# EAGLE design mgr (EAGLE 7.1.0)
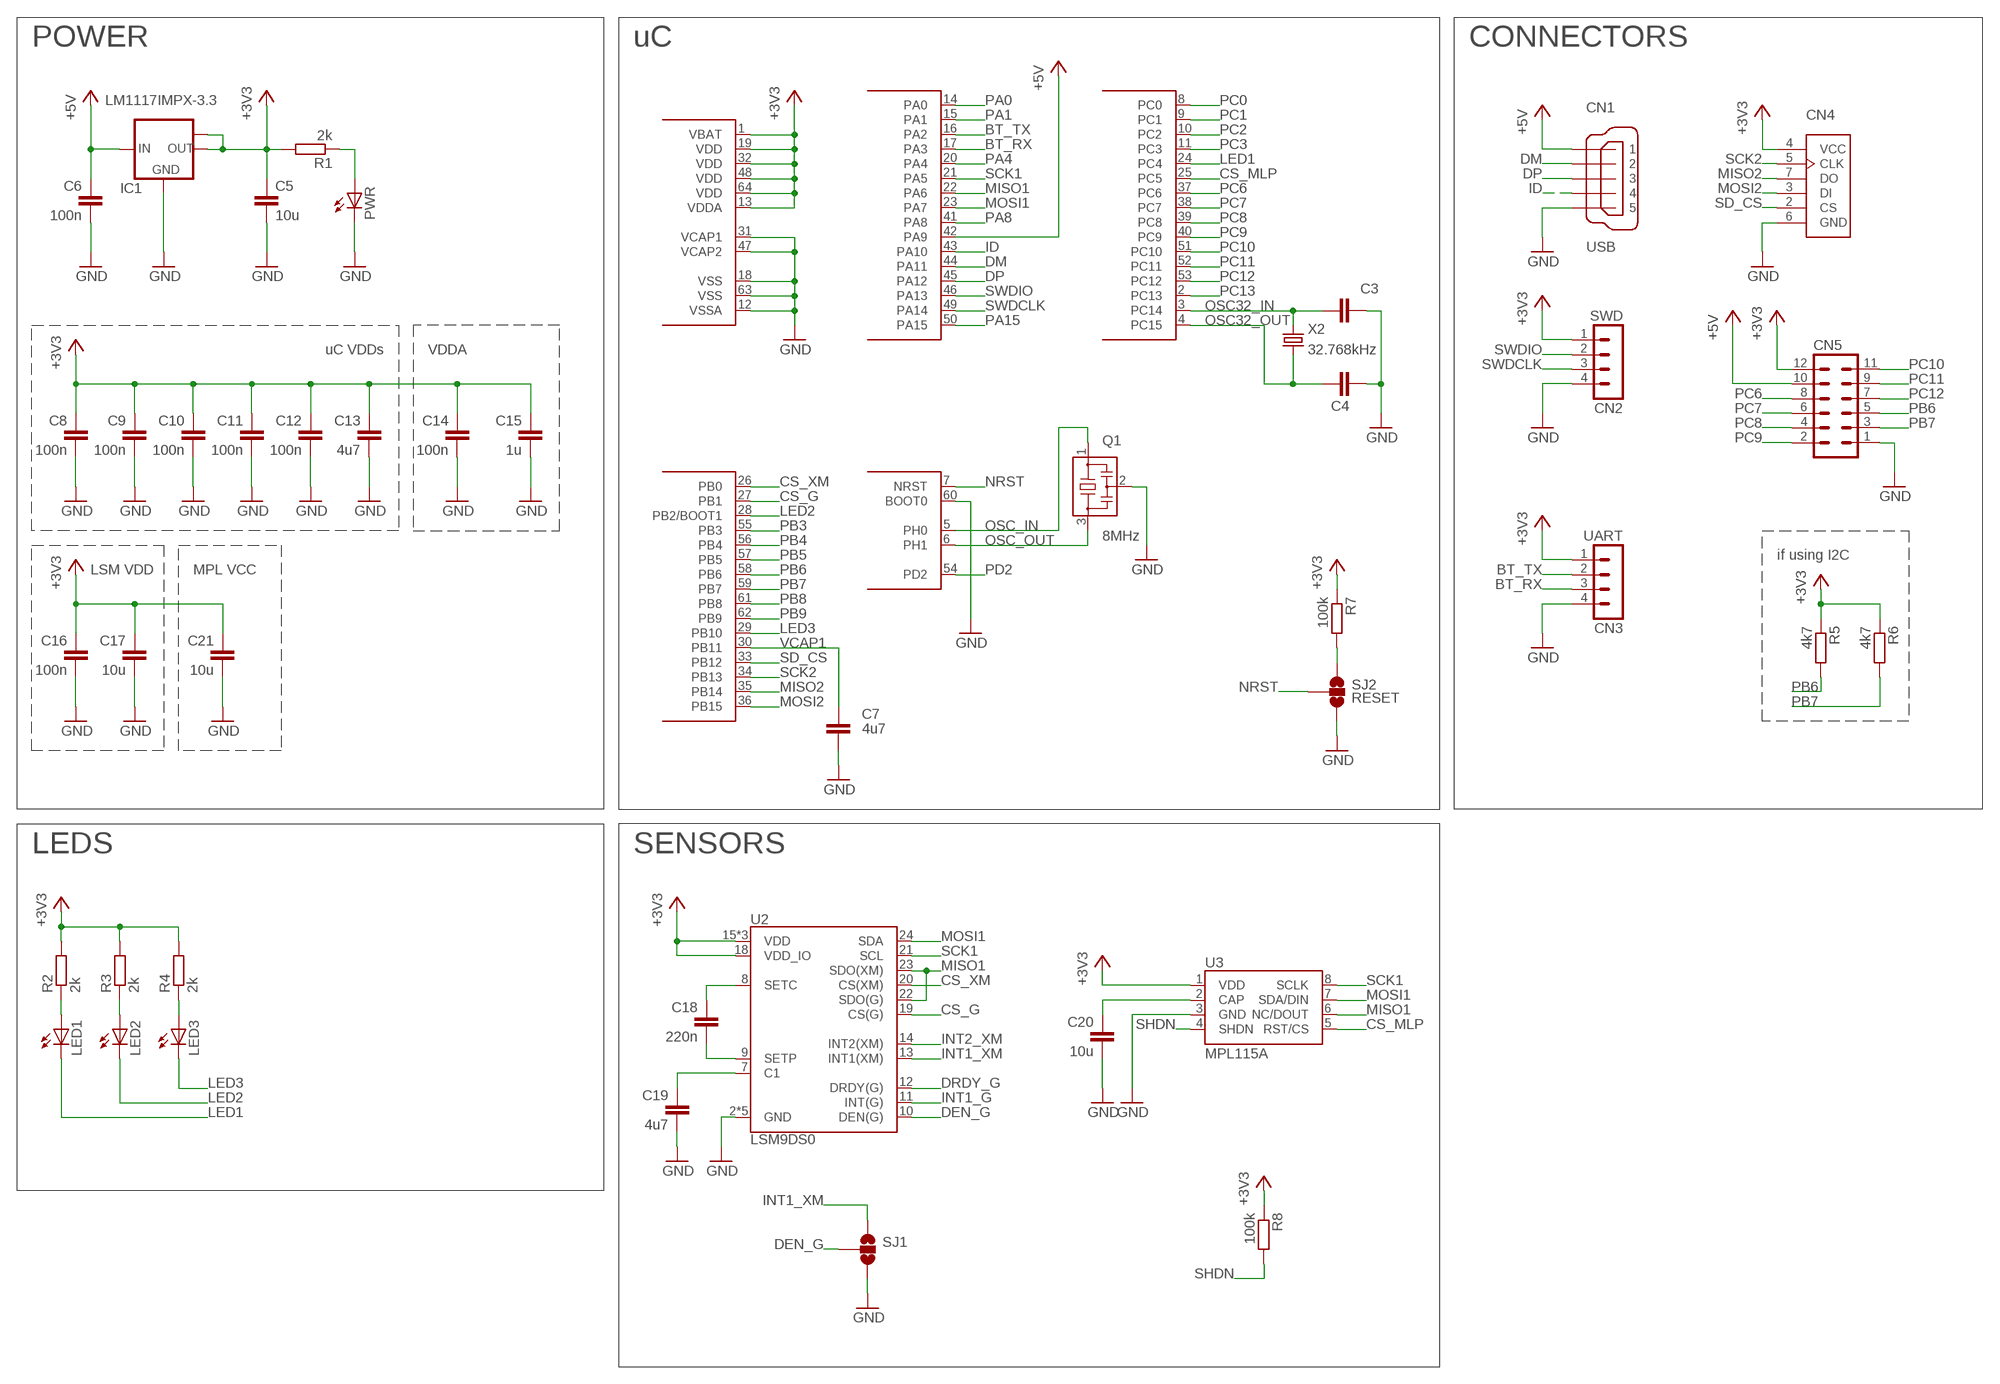
[diagram p0: schematic, sheet 1]

## Parts
C3  C-EUC0603K  [C0603K]
C4  C-EUC0603K  [C0603K]
C5  10u  C-EUC0603K  [C0603K]
C6  100n  C-EUC0603K  [C0603K]
C7  4u7  C-EUC0603K  [C0603K]
C8  100n  C-EUC0603K  [C0603K]
C9  100n  C-EUC0603K  [C0603K]
C10  100n  C-EUC0603K  [C0603K]
C11  100n  C-EUC0603K  [C0603K]
C12  100n  C-EUC0603K  [C0603K]
C13  4u7  C-EUC0603K  [C0603K]
C14  100n  C-EUC0603K  [C0603K]
C15  1u  C-EUC0603K  [C0603K]
C16  100n  C-EUC0603K  [C0603K]
C17  10u  C-EUC0603K  [C0603K]
C18  220n  C-EUC0603K  [C0603K]
C19  4u7  C-EUC0603K  [C0603K]
C20  10u  C-EUC0603K  [C0603K]
C21  10u  C-EUC0603K  [C0603K]
CN1  USB  MINI-USB-UX60-MB-5ST  [UX60-MB-5ST]
CN2  SWD  MA04-1  [MA04-1]
CN3  UART  MA04-1  [MA04-1]
CN4  MICRO_SD_CONNECTOR  [MICROSD_CONNECTOR]
CN5  MA06-2  [MA06-2]
IC1  LM1117IMPX-3.3  [SOT223]
LED1  LEDSML0603  [SML0603]
LED2  LEDSML0603  [SML0603]
LED3  LEDSML0603  [SML0603]
PWR  LEDSML0603  [SML0603]
Q1  8MHz  CSTCR6M00G53Z  [CSTCR6M]
R1  2k  R-EU_R0603  [R0603]
R2  2k  R-EU_R0603  [R0603]
R3  2k  R-EU_R0603  [R0603]
R4  2k  R-EU_R0603  [R0603]
R5  4k7  R-EU_R0603  [R0603]
R6  4k7  R-EU_R0603  [R0603]
R7  100k  R-EU_R0603  [R0603]
R8  100k  R-EU_R0603  [R0603]
SJ1  JUMPER-PAD-3-NOYES_SILK  [PAD-JUMPER-3-NO_YES_SILK]
SJ2  RESET  JUMPER-PAD-3-NOYES_SILK  [PAD-JUMPER-3-NO_YES_SILK]
U1  STM32F4-64  [SQFP-S-10X10-64]
U2  LSM9DS0  [LGA-24]
U3  MPL115A  [LGA8]
X2  32.768kHz  CRYSTALS-NOGND-CFPX-217  [3.2X1.5-2-PAD]

## Nets
+3V3: C5.2 C8.2 C9.2 C10.2 C11.2 C12.2 C13.2 C14.2 C15.2 C16.2 C17.2 C21.2 CN2.1 CN3.1 CN4.4(VCC) CN5.12 IC1.2(OUT) IC1.TAB(OUT1) R1.2 R2.2 R3.2 R4.2 R5.1 R6.1 R7.1 R8.1 U1.1(VBAT) U1.13(VDDA) U1.19(VDD) U1.32(VDD) U1.48(VDD) U1.64(VDD) U2.15(VDD) U2.16(VDD) U2.17(VDD) U2.18(VDD_IO) U3.1(VDD)
+5V: C6.2 CN1.1 CN5.10 IC1.3(IN) U1.42(PA9)
BT_RX: CN3.3 U1.17(PA3)
BT_TX: CN3.2 U1.16(PA2)
CS_G: U1.27(PB1) U2.19(CS(G))
CS_MLP: U1.25(PC5) U3.5(RST/CS)
CS_XM: U1.26(PB0) U2.20(CS(XM))
DEN_G: SJ1.2 U2.10(DEN(G))
DM: CN1.2 U1.44(PA11)
DP: CN1.3 U1.45(PA12)
DRDY_G: U2.12(DRDY(G))
GND: C3.2 C4.2 C5.1 C6.1 C7.2 C8.1 C9.1 C10.1 C11.1 C12.1 C13.1 C14.1 C15.1 C16.1 C17.1 C19.1 C20.1 C21.1 CN1.5 CN2.4 CN3.4 CN4.6(GND) CN5.1 IC1.1(GND) PWR.C Q1.2 SJ1.3 SJ2.3 U1.12(VSSA) U1.18(VSS) U1.31(VCAP1) U1.47(VCAP2) U1.60(BOOT0) U1.63(VSS) U2.2(GND) U2.3(GND) U2.4(GND) U2.5(GND) U2.6(GND) U3.3(GND)
ID: CN1.4 U1.43(PA10)
INT1_G: U2.11(INT(G))
INT1_XM: SJ1.1 U2.13(INT1(XM))
INT2_XM: U2.14(INT2(XM))
LED1: LED1.C U1.24(PC4)
LED2: LED2.C U1.28(PB2/BOOT1)
LED3: LED3.C U1.29(PB10)
MISO1: U1.22(PA6) U2.22(SDO(G)) U2.23(SDO(XM)) U3.6(NC/DOUT)
MISO2: CN4.7(DO) U1.35(PB14)
MOSI1: U1.23(PA7) U2.24(SDA) U3.7(SDA/DIN)
MOSI2: CN4.3(DI) U1.36(PB15)
N$1: PWR.A R1.1
N$2: C19.2 U2.7(C1)
N$3: C18.1 U2.9(SETP)
N$4: C18.2 U2.8(SETC)
N$5: LED1.A R2.1
N$6: LED2.A R3.1
N$7: LED3.A R4.1
N$8: C20.2 U3.2(CAP)
N$11: R7.2 SJ2.1
NRST: SJ2.2 U1.7(NRST)
OSC32_IN: C3.1 U1.3(PC14) X2.1
OSC32_OUT: C4.1 U1.4(PC15) X2.2
OSC_IN: Q1.1 U1.5(PH0)
OSC_OUT: Q1.3 U1.6(PH1)
PA0: U1.14(PA0)
PA1: U1.15(PA1)
PA4: U1.20(PA4)
PA8: U1.41(PA8)
PA15: U1.50(PA15)
PB3: U1.55(PB3)
PB4: U1.56(PB4)
PB5: U1.57(PB5)
PB6: CN5.5 R5.2 U1.58(PB6)
PB7: CN5.3 R6.2 U1.59(PB7)
PB8: U1.61(PB8)
PB9: U1.62(PB9)
PC0: U1.8(PC0)
PC1: U1.9(PC1)
PC2: U1.10(PC2)
PC3: U1.11(PC3)
PC6: CN5.8 U1.37(PC6)
PC7: CN5.6 U1.38(PC7)
PC8: CN5.4 U1.39(PC8)
PC9: CN5.2 U1.40(PC9)
PC10: CN5.11 U1.51(PC10)
PC11: CN5.9 U1.52(PC11)
PC12: CN5.7 U1.53(PC12)
PC13: U1.2(PC13)
PD2: U1.54(PD2)
SCK1: U1.21(PA5) U2.21(SCL) U3.8(SCLK)
SCK2: CN4.5(CLK) U1.34(PB13)
SD_CS: CN4.2(CS) U1.33(PB12)
SHDN: R8.2 U3.4(SHDN)
SWDCLK: CN2.3 U1.49(PA14)
SWDIO: CN2.2 U1.46(PA13)
VCAP1: C7.1 U1.30(PB11)

## Notes on the sheet
- POWER | uC | CONNECTORS
- uC VDDs | VDDA
- if using I2C
- LSM VDD | MPL VCC
- LEDS | SENSORS

## Library data of the parts
C3-C21 = resistor:C-EU: CAPACITOR, European symbol; SPICEPREFIX: C
CN1 = con-hirose:MINI-USB-: MINI USB Connector Source: http://www.hirose.co.jp/cataloge_hp/e24000019.pdf; OC_FARNELL: unknown; OC_NEWARK: unknown
CN2 CN3 = con-lstb:MA04-1: PIN HEADER; OC_FARNELL: unknown; OC_NEWARK: unknown
CN4 = mgr_con_sd:MICRO_SD_CONNECTOR: MicroSD connector with SPI interface
CN5 = con-lstb:MA06-2: PIN HEADER; OC_FARNELL: unknown; OC_NEWARK: unknown
IC1 = lm1117:LM1117IMPX-*
LED1-LED3 PWR = led:LED: LED OSRAM: - CHIPLED LG R971, LG N971, LY N971, LG Q971, LY Q971, LO R971, LY R971 LH N974, LH R974 LS Q976, LO Q976, LY Q976 LO Q996 - Hyper CHIPLED LW Q18S LB Q993, LB Q99A, LB R99A - SideLED LS A670, LO A670, LY A670, LG A670, LP A670 LB A673, LV A673, LT A673, LW A673 LH A674 LY A675 LS A676, LA A676, LO A676, LY A676, LW A676 LS A679, LY A679, LG A679 - Hyper Micro SIDELED® LS Y876, LA Y876, LO Y876, LY Y876 LT Y87S - SmartLED LW L88C, LW L88S LB L89C, LB L89S, LG L890 LS L89K, LO L89K, LY L89K LS L896, LA L896, LO L896, LY L896 - TOPLED LS T670, LO T670, LY T670, LG T670, LP T670 LSG T670, LSP T670, LSY T670, LOP T670, LYG T670 LG T671, LOG T671, LSG T671 LB T673, LV T673, LT T673, LW T673 LH T674 LS T676, LA T676, LO T676, LY T676, LB T676, LH T676, LSB T676, LW T676 LB T67C, LV T67C, LT T67C, LS T67K, LO T67K, LY T67K, LW E67C LS E67B, LA E67B, LO E67B, LY E67B, LB E67C, LV E67C, LT E67C LW T67C LS T679, LY T679, LG T679 LS T770, LO T770, LY T770, LG T770, LP T770 LB T773, LV T773, LT T773, LW T773 LH T774 LS E675, LA E675, LY E675, LS T675 LS T776, LA T776, LO T776, LY T776, LB T776 LHGB T686 LT T68C, LB T68C - Hyper Mini TOPLED® LB M676 - Mini TOPLED Santana® LG M470 LS M47K, LO M47K, LY M47K Source: http://www.osram.convergy.de LUXEON: - LUMILED® LXK2-PW12-R00, LXK2-PW12-S00, LXK2-PW14-U00, LXK2-PW14-V00 LXK2-PM12-R00, LXK2-PM12-S00, LXK2-PM14-U00 LXK2-PE12-Q00, LXK2-PE12-R00, LXK2-PE12-S00, LXK2-PE14-T00, LXK2-PE14-U00 LXK2-PB12-K00, LXK2-PB12-L00, LXK2-PB12-M00, LXK2-PB14-N00, LXK2-PB14-P00, LXK2-PB14-Q00 LXK2-PR12-L00, LXK2-PR12-M00, LXK2-PR14-Q00, LXK2-PR14-R00 LXK2-PD12-Q00, LXK2-PD12-R00, LXK2-PD12-S00 LXK2-PH12-R00, LXK2-PH12-S00 LXK2-PL12-P00, LXK2-PL12-Q00, LXK2-PL12-R00 Source: www.luxeon.com KINGBRIGHT: KA-3528ASYC Source: www.kingbright.com
Q1 = murata-filter:CSTCR: Resonator Source: murata.co.jp; MPN: CSTCR6M00G53-R0; OC_FARNELL: 1170434; OC_NEWARK: 25M8759
R1-R8 = resistor:R-EU_: RESISTOR, European symbol; SPICEPREFIX: R
SJ1 SJ2 = SparkFun-Passives:JUMPER-PAD-3-NO
U1 = apbteam_stm32:STM32F4-64: STM32F4, 64 pin package According to STM32F40x datasheet, compatible with STM32F4xx, STM32F2xx. Also compatible with STM32F10x, if VCAP1 and VCAP2 are connected directly to VSS.
U2 = SparkFun-DigitalIC:LSM9DS0: LSM9DS0 3D Accelerometer, 3D Gyroscope, 3D Magnetomter Features: 3 acceleration channels, 3 angular rate channels, 3 magnetic field channels ±2/±4/±6/±8/±16 g linear acceleration full scale ±2/±4/±8/±12 gauss magnetic full scale ±245/±500/±2000 dps angular rate full scale 16-bit data output SPI / I2C serial interfaces Analog supply voltage 2.4 V to 3.6 V Power-down mode / low-power mode Programmable interrupt generators Embedded self-test Embedded temperature sensor Embedded FIFO Position and motion detection functions Click/double-click recognition
U3 = SparkFun-Sensors:MPL115A: MPL115A1 (SPI) and MPL115A2 (I2C) Miniature Digital Barometer 5.0x3.0x1.2mm LGA Package
X2 = IQD-Frequency-Products:CRYSTALS-NOGND: CRYSTALS CAN NOT GROUNDED

## Board
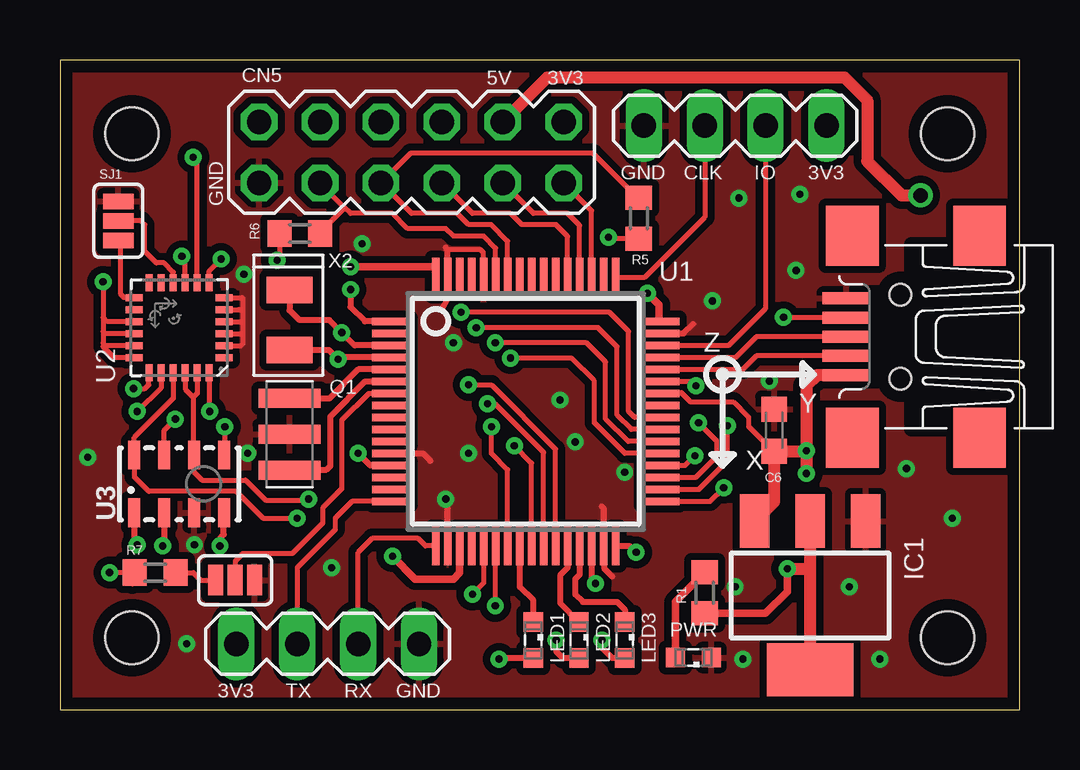
[diagram p1: board, top side]
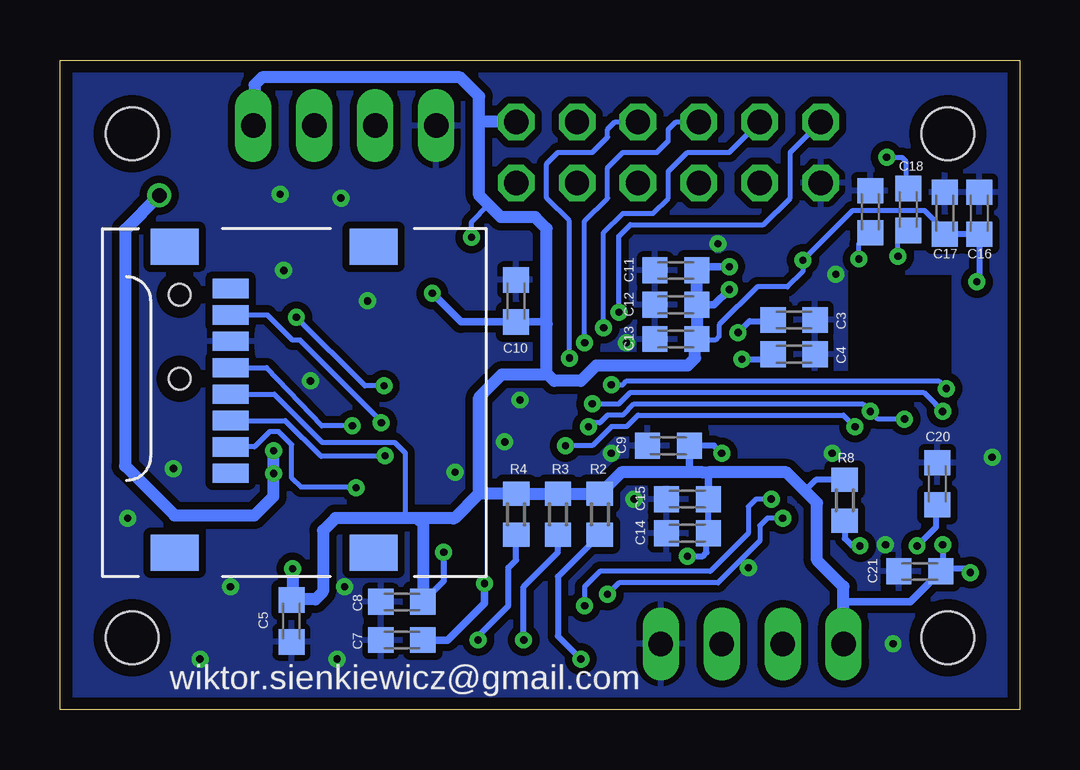
[diagram p2: board, bottom side, seen from below]

Size 40.02 x 27.07 mm. Coordinates in mm from the lower left corner, seen from the top.
Outline: 0,0 40.02,0 40.02,27.07 0,27.07 0,0
Copper layers (1*16): Top 0.035mm / dielectric 1.5mm / Bottom 0.035mm
Design rules "default *": minimum track width 8mil, minimum drill 0.3mm, track to track 8mil, track to pad 8mil, pad to pad 8mil, via to via 8mil, smd to smd 8mil, copper to edge 20mil, drill to drill 8mil, minimum pad ring 10mil, minimum via ring 8mil, stop-mask expansion 0mil, vias tented up to drill 12mil, thermal gap 10mil
Holes 2.2 mm at 3,24 37,24 37,3 3,3

### Footprints (pad centres in the part's own frame; a part is rotated, then mirrored left to right if it is on the bottom)
C0603K = smd 1.05 x 1.08: 1 -0.875,0; 2 0.875,0
UX60-MB-5ST = smd 2 x 0.5: 1 2.25,1.6; 2 2.25,0.8; 3 2.25,0; 4 2.25,-0.8; 5 2.25,-1.6 | smd 2.2 x 2.5: M1 -3.3,-4.2; M2 -3.3,4.2; M3 2,4.2; M4 2,-4.2 | hole 0.9: 0,-1.75; 0,1.75
MA04-1 = drill 1.016 long: 1 -3.81,0; 2 -1.27,0; 3 1.27,0; 4 3.81,0
MICROSD_CONNECTOR = smd 0.8 x 1.5: 1 2.58,-4.27; 2 1.48,-4.27; 3 0.38,-4.27; 4 -0.72,-4.27; 5 -1.82,-4.27; 6 -2.92,-4.27; 7 -4.02,-4.27; 8 -5.12,-4.27 | smd 1.5 x 2: NC1 -6.87,1.68; NC2 5.88,1.68; NC3 -6.87,-6.62; NC4 5.88,-6.62
MA06-2 = drill 1.016 octagon: 1 -6.35,-1.27; 2 -6.35,1.27; 3 -3.81,-1.27; 4 -3.81,1.27; 5 -1.27,-1.27; 6 -1.27,1.27; 7 1.27,-1.27; 8 1.27,1.27; 9 3.81,-1.27; 10 3.81,1.27; 11 6.35,-1.27; 12 6.35,1.27
SOT223 = smd 1.219 x 2.235: 1 -2.311,-3.099; 2 0,-3.099; 3 2.311,-3.099 | smd 3.6 x 2.2: TAB 0,3.099
SML0603 = smd 0.8 x 0.8: A 0.75,0; C -0.75,0
CSTCR6M = smd 0.8 x 2.6: 1 -1.5,0; 2 0,0; 3 1.5,0
R0603 = smd 1 x 1.1: 1 -0.85,0; 2 0.85,0
PAD-JUMPER-3-NO_YES_SILK = smd 0.635 x 1.27: 1 -0.813,0; 2 0,0; 3 0.813,0
SQFP-S-10X10-64 = smd 0.3 x 1.6: 1 -3.75,-5.6; 2 -3.25,-5.6; 3 -2.75,-5.6; 4 -2.25,-5.6; 5 -1.75,-5.6; 6 -1.25,-5.6; 7 -0.75,-5.6; 8 -0.25,-5.6; 9 0.25,-5.6; 10 0.75,-5.6; 11 1.25,-5.6; 12 1.75,-5.6; 13 2.25,-5.6; 14 2.75,-5.6; 15 3.25,-5.6; 16 3.75,-5.6; 33 3.75,5.6; 34 3.25,5.6; 35 2.75,5.6; 36 2.25,5.6; 37 1.75,5.6; 38 1.25,5.6; 39 0.75,5.6; 40 0.25,5.6; 41 -0.25,5.6; 42 -0.75,5.6; 43 -1.25,5.6; 44 -1.75,5.6; 45 -2.25,5.6; 46 -2.75,5.6; 47 -3.25,5.6; 48 -3.75,5.6 | smd 1.6 x 0.3: 17 5.6,-3.75; 18 5.6,-3.25; 19 5.6,-2.75; 20 5.6,-2.25; 21 5.6,-1.75; 22 5.6,-1.25; 23 5.6,-0.75; 24 5.6,-0.25; 25 5.6,0.25; 26 5.6,0.75; 27 5.6,1.25; 28 5.6,1.75; 29 5.6,2.25; 30 5.6,2.75; 31 5.6,3.25; 32 5.6,3.75; 49 -5.6,3.75; 50 -5.6,3.25; 51 -5.6,2.75; 52 -5.6,2.25; 53 -5.6,1.75; 54 -5.6,1.25; 55 -5.6,0.75; 56 -5.6,0.25; 57 -5.6,-0.25; 58 -5.6,-0.75; 59 -5.6,-1.25; 60 -5.6,-1.75; 61 -5.6,-2.25; 62 -5.6,-2.75; 63 -5.6,-3.25; 64 -5.6,-3.75
LGA-24 = smd 0.7 x 0.29: 1 -1.875,1.25; 2 -1.875,0.75; 3 -1.875,0.25; 4 -1.875,-0.25; 5 -1.875,-0.75; 6 -1.875,-1.25; 13 1.875,-1.25; 14 1.875,-0.75; 15 1.875,-0.25; 16 1.875,0.25; 17 1.875,0.75; 18 1.875,1.25 | smd 0.29 x 0.7: 7 -1.25,-1.875; 8 -0.75,-1.875; 9 -0.25,-1.875; 10 0.25,-1.875; 11 0.75,-1.875; 12 1.25,-1.875; 19 1.25,1.875; 20 0.75,1.875; 21 0.25,1.875; 22 -0.25,1.875; 23 -0.75,1.875; 24 -1.25,1.875
LGA8 = smd 1.2 x 0.5: 1 -1.2,1.875; 2 -1.2,0.625; 3 -1.2,-0.625; 4 -1.2,-1.875; 5 1.2,-1.875; 6 1.2,-0.625; 7 1.2,0.625; 8 1.2,1.875
3.2X1.5-2-PAD = smd 1.1 x 1.9: 1 -1.25,0; 2 1.25,0

### Placement (x,y rotation side)
C3  9.41,16.24 0 bottom
C4  9.41,14.81 0 bottom
C5  30.37,3.7 90 bottom
C6  29.77,11.64 270 top
C7  25.77,2.9 180 bottom
C8  25.77,4.49 0 bottom
C9  14.65,11 0 bottom
C10  21,17.03 270 bottom
C11  14.34,18.3 0 bottom
C12  14.34,16.88 0 bottom
C13  14.34,15.45 0 bottom
C14  13.86,7.35 0 bottom
C15  13.86,8.78 0 bottom
C16  1.7,20.68 270 bottom
C17  3.13,20.68 270 bottom
C18  4.65,20.84 90 bottom
C19  6.24,20.75 270 bottom
C20  3.44,9.41 270 bottom
C21  4.17,5.76 0 bottom
CN1  35.03,15.54 180 top
CN2  28.15,24.34 180 top
CN3  11.16,2.75 0 top
CN4  28.62,12.43 270 bottom
CN5  14.65,23.23 0 top
IC1  31.27,4.76 180 top
LED1  19.73,2.9 270 top
LED2  21.64,2.9 270 top
LED3  23.54,2.9 270 top
PWR  26.4,2.17 180 top
Q1  9.57,11.48 270 top
R1  26.88,4.87 270 top
R2  17.51,8.14 90 bottom
R3  19.26,8.14 90 bottom
R4  21,8.14 90 bottom
R5  24.13,20.48 90 top
R6  10,19.84 0 top
R7  3.97,5.71 0 top
R8  7.3,8.73 270 bottom
SJ1  2.43,20.37 90 top
SJ2  7.3,5.4 0 top
U1  19.41,12.43 270 top
U2  4.97,15.92 180 top
U3  4.97,9.41 90 top
X2  9.57,16.24 270 top

### Tracks (layer width: path | path; a pad name or v marks a point on that pad's centre or on a via)
+3V3  (via drill 0.3)
  Top 0.203: v1.79,17.83 1.79,16.35 | 1.79,16.35 1.79,15.76 | 1.79,15.76 1.79,15.29 | 1.79,15.29 1.79,15.13 2.25,14.67 U2.18 | U2.17 1.91,15.17 1.79,15.29 | U2.16 1.89,15.67 1.79,15.76 | U2.15 1.97,16.17 1.79,16.35 | R6.1 9.15,18.84 v9.05,18.73 | R5.1 23.07,19.63 v22.86,19.68 | 3.02,5.24 R7.1 v2.06,5.71
  Top 0.254: U3.1 3.09,7 v3.22,6.87 | U1.32 23.75,6.83 v24.02,6.56 | U1.13 12.93,10.18 v12.43,10.68 | U1.1 12.71,16.18 12.11,16.78 v12.11,17.51
  Top 0.305: v12.11,18.46 15.66,18.46 U1.64 | U1.48 24.97,16.22 24.97,16.88 v24.5,17.35 | U1.19 16.66,5.71 16.4,5.45 14.81,5.45 v13.86,6.4 | R1.2 29.42,4.02 30.32,4.92 v30.32,5.87
  Top 0.508: 31.27,7.46 IC1.2 31.27,5.87 | IC1.TAB 31.27,5.87 | v30.32,5.87 31.27,5.87
  Bottom 0.203: C13.2 13.41,15.4 12.7,15.4 12.54,15.56 12.54,16.03 10.95,17.62 9.68,17.62 9.05,18.26 v9.05,18.73 6.99,20.8 3.97,20.8 3.13,19.95 C17.2 | v22.86,19.68 22.86,20.32 22.15,21.03 | 2.22,5.87 v2.06,5.71 | CN4.4 31.09,13.15 29.08,11.14 26.07,11.14 25.62,10.7 25.62,7.99
  Bottom 0.254: v3.22,6.87 3.22,5.84 | v24.02,6.56 24.02,5.36 C8.2 | 23.7,7.99 24.65,7.99 24.89,7.75 | v13.86,6.4 13.22,6.4 13.06,6.56 13.06,7.27 C14.2 C15.2 | v12.43,10.68 12.75,11 C9.2 | R8.1 8.52,9.58 8.97,9.13 | 2.22,5.87 3.19,5.87 C21.2 | v1.79,17.83 1.7,17.92 C16.2 C17.2
  Bottom 0.305: 13.7,18.22 C11.2 13.38,18.3 13.06,18.46 v12.11,18.46 | C15.2 12.98,9.89 | v12.11,17.51 12.75,16.88 C12.2 | 19.73,16.08 19.81,16.16 C10.2 23.31,16.16 v24.5,17.35 | 7.35,4.49 4.57,4.49 C21.2 3.22,5.84 | C9.2 13.78,9.81 13.22,9.89
  Bottom 0.406: 13.54,15.52 C13.2
  Bottom 0.508: C13.2 C12.2 C11.2 | 25.13,7.99 24.89,7.75 C8.2 | 13.54,15.52 13.54,14.65 13.86,14.34 17.67,14.34 18.3,13.7 19.41,13.7 19.73,14.02 | CN3.1 7.35,4.49 7.35,5.13 8.46,6.24 8.46,8.62 8.97,9.13 9.73,9.89 12.98,9.89 13.22,9.89 16.61,9.89 R2.2 R3.2 R4.2 22.54,8.99 | 19.73,14.02 19.73,16.08 19.73,20.05 20.21,20.53 21.64,20.53 22.15,21.03 22.54,21.43 22.54,24.45 | 30.34,4.6 29.37,4.6 29.05,4.92 29.05,7.46 28.53,7.99 25.62,7.99 23.7,7.99 23.55,7.99 22.54,8.99 | 22.54,24.45 22.54,25.56 23.34,26.35 31.59,26.35 31.91,26.04 31.91,24.38 CN2.1 | CN5.12 22.5,24.5 22.54,24.45 | 22.54,8.99 22.54,13.02 21.59,13.97 19.78,13.97 19.73,14.02 | v30.32,5.87 30.32,4.46 30.34,4.6 | 30.34,4.6 C5.2
+5V  (via drill 0.3, 0.6)
  Top 0.203: U1.42 25.04,13.21 25.91,13.21 26.29,12.83 28.07,12.83 28.7,12.19 28.7,11.81 29.75,10.77 C6.2
  Top 0.508: CN5.10 20.32,26.35 32.7,26.35 33.66,25.4 33.66,22.86 35.08,21.43 v35.88,21.43 | CN1.1 31.56,13.94 31.11,13.49 31.11,10.95 | 31.11,10.95 v31.11,10.79 v31.11,9.84 | 31.11,10.95 30.93,10.77 C6.2 29.77,8.67 IC1.3
  Bottom 0.508: v35.88,21.43 37.31,20 37.31,10.16 35.24,8.1 31.91,8.1 31.11,8.89 v31.11,9.84 v31.11,10.79
BT_RX
  Top 0.203: U1.17 15.24,6.83 14.92,7.14 13.02,7.14 12.43,6.56 CN3.3
BT_TX
  Top 0.203: U1.16 12.17,8.68 11.48,7.99 11.48,7.51 9.89,5.92 CN3.2
CS_G  (via drill 0.3)
  Top 0.203: v3.06,13.38 3.54,13.38 3.7,13.54 3.7,14.03 U2.19 | U1.27 20.66,10.86 17.99,13.54 v17.03,13.54
  Bottom 0.203: v17.03,13.54 16.56,13.54 16.4,13.7 3.38,13.7 v3.06,13.38
CS_MLP  (via drill 0.3)
  Top 0.203: U1.25 19.66,10.28 v18.94,11 | v6.87,11.79 6.87,10.64 U3.5
  Bottom 0.203: v6.87,11.79 7.35,12.27 15.92,12.27 16.4,11.79 17.03,11.79 17.83,11 v18.94,11
CS_XM  (via drill 0.3)
  Top 0.203: v3.22,12.43 4.22,13.43 U2.20 | U1.26 20.16,10.73 18.14,12.75 v17.83,12.75
  Bottom 0.203: 3.54,12.75 v3.22,12.43 4.02,13.22 16.24,13.22 16.72,12.75 v17.83,12.75
DEN_G
  Top 0.203: U2.10 4.72,18.24 4.33,18.62 4.02,18.62 3.54,19.1 3.54,20.21 3.38,20.37 SJ1.2
DM
  Top 0.203: U1.44 28.47,14.18 29.03,14.74 CN1.2
DP
  Top 0.203: U1.45 28.17,14.68 29.04,15.54 CN1.3
GND  (via drill 0.3)
  Top 0.203: U1.60 17.65,19.05 17.53,19.17 16.16,19.17 | U2.6 7.59,17.17 7.62,17.14 7.62,16.67 | 7.62,16.67 7.62,16.19 | 7.62,16.19 7.62,15.72 | 7.62,15.72 7.62,15.24 7.55,15.17 U2.2 | U2.3 7.58,15.67 7.62,15.72 | U2.4 7.6,16.17 7.62,16.19 | U2.5 7.46,16.67 7.62,16.67
  Top 0.254: 22.59,8.46 22.66,8.39 U1.31 22.67,6.29 22.68,5.9 23.02,5.56 | U1.47 26,15.68 26.4,16.08 | 16.08,19.26 16.16,19.17 U1.63 16.16,17.12 15.92,16.72 | U1.18 16.16,8.38 v16.08,8.78 | U1.12 15.13,10.68 15.45,10.37
  other vias: 28.46,2.11 28.15,5.13 5.29,2.75 11.32,5.92 5.6,6.87 17.03,10.68 7.83,10.68 30.69,18.3 28.3,21.32 12.59,19.41 20.84,12.91 21.48,11.16 27.19,17.03 16.4,15.29 37.2,7.99 32.91,5.13 30.84,21.48 35.29,10.05 29.57,13.7 34.18,2.11 1.16,10.53 23.54,9.89 7.67,18.14
  pour Top (isolate 0.305): -1.54,28.94 44.34,29.1 44.34,-1.38 -1.54,-1.54
  pour Bottom (isolate 0.305): -0.27,27.67 -0.27,-0.27 42.56,-0.11 42.56,27.83
ID  (via drill 0.3)
  Top 0.203: U1.43 26.32,13.68 v26.51,13.49 | v30.16,16.35 v30.15,16.34 CN1.4
  Bottom 0.203: v26.51,13.49 27.3,13.49 v30.16,16.35
INT1_XM
  Top 0.203: U2.13 2.67,17.17 2.54,17.3 2.54,19.44 SJ1.1
LED1
  Top 0.254: U1.24 19.16,5.12 19.73,4.56 LED1.C
LED2
  Top 0.254: U1.28 21.16,5.92 20.84,5.6 20.84,4.45 LED2.C
LED3
  Top 0.254: U1.29 21.66,5.63 21.48,5.45 21.48,4.81 21.8,4.49 23.23,4.49 23.54,4.17 LED3.C
MISO1  (via drill 0.3)
  Top 0.203: U2.23 5.72,13.18 5.56,13.02 | 5.6,10.62 U3.6 | U1.22 18.14,6.81 v18.14,4.33 | U3.6 5.59,9.9 5.92,9.57 7.73,9.57 8.57,8.73 10.16,8.73 v10.37,8.78 | 5.56,13.02 5.56,10.65 U3.6 | U2.22 5.22,13.36 5.56,13.02
  Bottom 0.203: v10.37,8.78 11,8.78 11.32,8.46 11.32,7.35 12.91,5.76 17.51,5.76 18.14,5.13 v18.14,4.33
MISO2  (via drill 0.3)
  Top 0.203: U1.35 26.51,9.68 27.38,10.56 27.38,11.19 v26.62,11.95
  Bottom 0.203: CN4.7 31.37,16.45 30.32,15.4 30,15.4 26.62,12.02 v26.62,11.95
MOSI1  (via drill 0.3)
  Top 0.203: U1.23 18.66,10.01 17.99,10.68 v17.99,11.79 | v6.24,12.43 6.24,14.03 U2.24 | U3.7 4.34,11.65 v4.81,12.11
  Bottom 0.203: v4.81,12.11 5.92,12.11 v6.24,12.43 6.56,12.75 16.08,12.75 16.56,12.27 17.19,12.27 17.51,11.95 17.83,11.95 v17.99,11.79
MOSI2  (via drill 0.3)
  Top 0.203: U1.36 26.05,10.18 v26.46,10.59
  Bottom 0.203: v26.46,10.59 26.43,10.56 29.13,10.56 30.62,12.05 CN4.3
N$1
  Top 0.305: PWR.A 25.65,4.5 R1.1
N$2  (via drill 0.3)
  Top 0.203: U2.7 6.22,18.28 v6.71,18.78
  Bottom 0.203: v6.71,18.78 6.71,19.4 C19.2
N$3  (via drill 0.3)
  Top 0.203: U2.9 5.22,18.75 v5.08,18.89
  Bottom 0.203: v5.08,18.89 5.08,19.7 C18.1
N$4  (via drill 0.3)
  Top 0.203: U2.8 5.72,22.86 v5.56,23.02
  Bottom 0.203: v5.56,23.02 4.92,23.02 4.76,22.86 4.76,21.67 C18.2
N$5  (via drill 0.3)
  Top 0.254: LED1.A 18.42,2.15 v18.3,2.11
  Bottom 0.254: R2.1 19.26,5.55 19.26,3.06 v18.3,2.11
N$6  (via drill 0.3)
  Top 0.254: LED2.A 20.96,2.15 20.68,2.43 v20.68,2.9
  Bottom 0.254: v20.68,2.9 20.68,5.13 19.26,6.56 R3.1
N$7  (via drill 0.3)
  Top 0.254: LED3.A 23.02,2.15 22.59,2.59 v22.59,2.9
  Bottom 0.254: v22.59,2.9 22.59,3.06 21.32,4.33 21.32,5.92 21,6.24 R4.1
N$8  (via drill 0.3)
  Top 0.254: U3.2 4.34,6.88 v4.29,6.83
  Bottom 0.254: 3.49,8.49 3.49,7.62 v4.29,6.83
  Bottom 0.305: 3.49,8.49 C20.2
N$9
  cutout Top: 6.35,17.46 7.46,17.46 7.46,14.45 6.35,14.45
N$11
  Top 0.203: R7.2 5.56,5.71 5.87,5.4 SJ2.1
N$12
  cutout Bottom: 2.86,18.1 2.86,13.81 7.14,13.81 7.14,18.1
NRST
  Top 0.203: U1.7 12.86,13.18 11.75,12.06 11.75,9.21 10.95,8.41 10.95,7.78 9.68,6.51 7.62,6.51 7.3,6.19 SJ2.2
OSC32_IN  (via drill 0.3)
  Top 0.254: U1.3 12.28,15.18 v11.75,15.72 11.22,16.24 9.97,16.24 9.57,16.64 X2.1
  Bottom 0.254: v11.75,15.72 11.27,16.19 10.34,16.19 C3.1
OSC32_OUT  (via drill 0.3)
  Top 0.254: U1.4 11.66,14.68 v11.59,14.61 11.2,14.99 X2.2
  Bottom 0.254: v11.59,14.61 10.49,14.61 C4.1
OSC_IN
  Top 0.254: Q1.1 11.23,12.98 12.43,14.18 U1.5
OSC_OUT
  Top 0.254: Q1.3 9.76,10 11.11,10 11.27,10.16 11.27,12.22 12.73,13.68 U1.6
PB6
  Top 0.203: U1.58 18.66,19.53 17.99,20.21 17.03,20.21 16.56,20.68 14.65,20.68 CN5.5 14.61,23.18 22.23,23.18 24.07,21.33 R5.2
PB7
  Top 0.203: U1.59 18.16,19.24 17.67,19.73 16.4,19.73 16.08,20.05 14.49,20.05 13.86,20.68 12.11,20.68 11.87,20.92 | 11.87,20.92 CN5.3 | R6.2 10.85,19.9 11.87,20.92
PC6  (via drill 0.3)
  Top 0.203: v18.78,14.65 21.32,14.65 22.27,13.7 22.27,11.95 23.55,10.68 U1.37
  Bottom 0.203: v18.78,14.65 18.78,20.37 19.73,21.32 19.73,22.75 19.26,23.23 17.83,23.23 17.19,23.86 17.19,24.18 16.88,24.5 CN5.8
PC7  (via drill 0.3)
  Top 0.203: v18.14,15.29 21.95,15.29 22.75,14.49 22.75,12.11 23.68,11.18 U1.38
  Bottom 0.203: v18.14,15.29 18.14,20.37 17.19,21.32 17.19,22.59 16.56,23.23 15.13,23.23 14.65,23.7 14.65,24.18 14.34,24.5 CN5.6
PC8  (via drill 0.3)
  Top 0.203: v17.35,15.92 22.43,15.92 23.23,15.13 23.23,12.27 23.82,11.68 U1.39
  Bottom 0.203: v17.35,15.92 17.35,19.89 16.56,20.68 15.29,20.68 14.65,21.32 14.65,22.43 13.86,23.23 12.11,23.23 CN5.4
PC9  (via drill 0.3)
  Top 0.203: v16.72,16.56 22.91,16.56 23.7,15.76 23.7,12.43 23.95,12.18 U1.40
  Bottom 0.203: v16.72,16.56 16.72,19.73 16.24,20.21 10.68,20.21 9.57,21.32 9.57,23.23 CN5.2
PC10
  Top 0.203: U1.51 22.16,20.79 CN5.11
PC11
  Top 0.203: U1.52 21.66,20.18 21.16,20.68 19.73,20.68 CN5.9
PC12
  Top 0.203: U1.53 21.16,19.73 20.68,20.21 19.26,20.21 18.78,20.68 17.19,20.68 CN5.7
SCK1  (via drill 0.3)
  Top 0.203: U2.21 4.72,12.97 3.09,11.35 U3.8 3.09,9.7 3.7,9.1 7.35,9.1 8.46,7.99 v9.89,7.99 | U1.21 17.66,5.29 v17.19,4.81
  Bottom 0.203: v17.19,4.81 16.72,5.29 12.59,5.29 10.84,7.03 10.84,7.67 10.53,7.99 v9.89,7.99
SCK2  (via drill 0.3)
  Top 0.203: U1.34 26.64,9.18 27.83,10.37 v27.83,11.83
  Bottom 0.203: CN4.5 31.39,14.25 29.1,11.83 v27.83,11.83
SD_CS  (via drill 0.3)
  Top 0.203: U1.33 27.09,8.68 v27.67,9.26
  Bottom 0.203: 32.47,10.68 CN4.2 | 32.57,10.79 CN4.2 | CN4.2 31.91,10.95 31.27,11.59 30.89,11.59 30.35,11.05 30.35,9.65 29.97,9.27 27.69,9.27 v27.67,9.26
SHDN  (via drill 0.3)
  Top 0.254: v6.67,6.83 6.67,7.14 6.83,7.3 6.83,8.2
  Top 0.305: 6.83,8.2 U3.4
  Bottom 0.254: R8.2 7.3,7.14 6.99,6.83 v6.67,6.83
SWDCLK
  Top 0.203: U1.49 24.38,18.03 26.88,20.53 CN2.3
SWDIO
  Top 0.203: CN2.2 29.42,16.72 27.88,15.18 U1.46
VCAP1  (via drill 0.3)
  Top 0.254: U1.30 22.16,5.42 v22.32,5.26
  Bottom 0.305: v22.32,5.26 22.32,4.44 23.86,2.9 C7.1

### Text on the board
tNames: 5V | 3V3 | GND | GND | CLK | IO | 3V3 | Z | Y | X | 3V3 | TX | RX | GND
bNames: wiktor.sienkiewicz@gmail.com